# EasyEDA Pro project MiddleMotor.eprj

# Schematic Schematic1
Board Name: Board1; Create Date: 2025-05-16; Page Name: P1; Project Name: MiddleMotor; Schematic Name: Schematic1; Update Date: 2025-05-17; Company: 嘉立创EDA; Drawed: 王大智; Page Size: A4; Version: V1.0
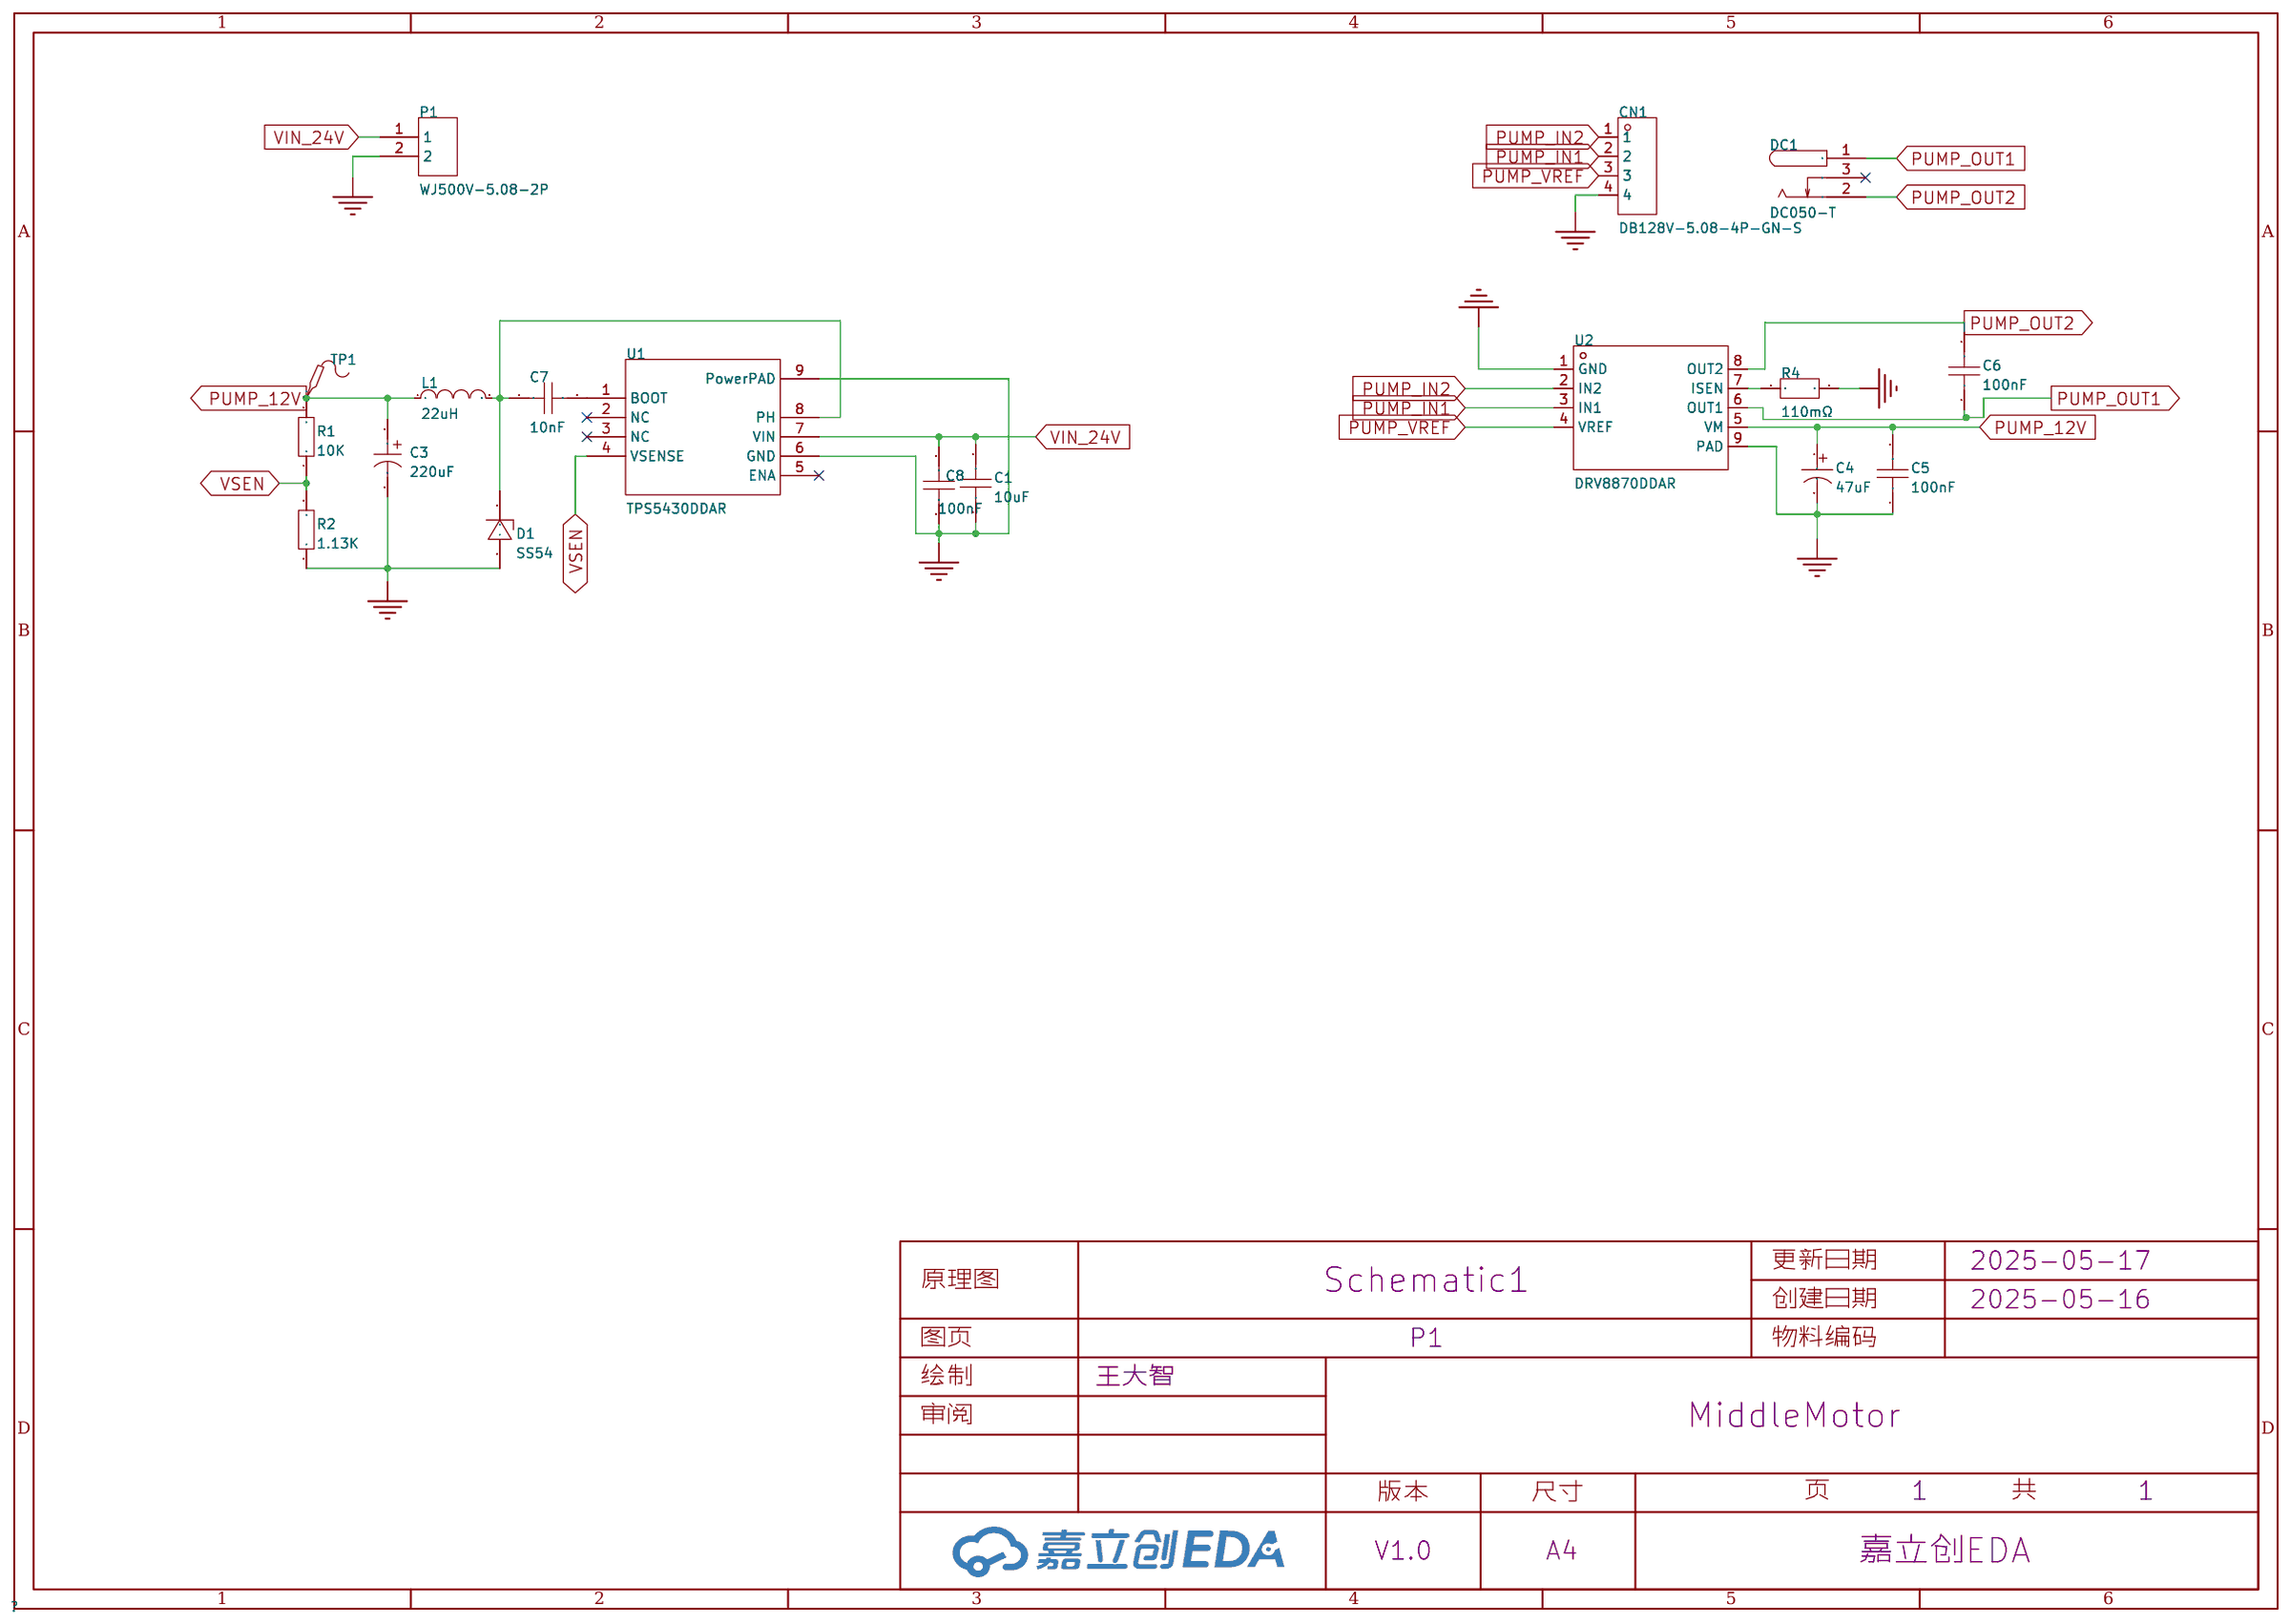
[diagram p0: schematic sheet]

## Parts
C1  10uF  [C1206]
C3  220uF  [CAP-SMD_BD8.0-L8.3-W8.3-FD]
C4  47uF  [CAP-TH_BD6.3-P2.50-D1.0-FD]
C5  100nF  [C0603]
C6  100nF  [C0603]
C7  10nF  [C0603]
C8  100nF  [C0603]
CN1  DB128V-5.08-4P-GN-S  [CONN-TH_4P-P5.08_DIBO_DB128V-5.08]
D1  SS54  [SMA_L4.3-W2.6-LS5.0-FD]
DC1  DC050-T  [DC-IN_DC050-T]
L1  22uH  [IND-SMD_L7.0-W6.6_FXL0630]
P1  WJ500V-5.08-2P  [CONN-TH_2P-P5.00_WJ500V-5.08-2P]
R1  10K  [R0603]
R2  1.13K  [R0603]
R4  110mΩ  [R1206]
TP1  -  [Test-Point-0.5mm]
U1  TPS5430DDAR  [ESOP-8_L4.9-W3.9-P1.27-LS6.0-TL-EP]
U2  DRV8870DDAR  [HSOP-8_L5.0-W4.0-P1.27-LS6.2-BL-EP]

## Library data of the parts
C1 = HGC1206R5106K500NSPJ: LCSC Part Name: 10uF ±10% 50V; Supplier Part: C7432781; Manufacturer: Chinocera(华瓷); Supplier Footprint: 1206; JLCPCB Part Class: 扩展库; Datasheet: https://atta.szlcsc.com/upload/public/pdf/source/20240320/FAC3FEC40A78BC5CCCE96C232A94D860.pdf; Supplier: LCSC; Tolerance: ±10%; Voltage Rating: 50V; Temperature Coefficient: X5R
C3 = GVT1V227M0810CNVC: LCSC Part Name: 220uF ±20% 35V; Supplier Part: C2983323; Manufacturer: HRK(鸿瑞凯电子); Supplier Footprint: SMD,D8xL10.5mm; JLCPCB Part Class: 扩展库; Datasheet: https://atta.szlcsc.com/upload/public/pdf/source/20220321/BA17E910A44EA2B508CDD6AB8BA576BA.pdf; Supplier: LCSC; Tolerance: ±20%; Rated Voltage: 35V; Ripple Current: 175mA@120Hz; φD: 8mm; L: 10.5mm; Lifetime @ Temp: 2000hrs@105℃; Operating Temperature: -55℃~+105℃
C4 = KM476M050E11RR0VH2FP0: 容值:47uF;精度:±20%;额定电压:50V;; LCSC Part Name: 47uF ±20% 50V; Supplier Part: C45101; Manufacturer: CX(承兴); Supplier Footprint: 插件,D6.3xL11mm; JLCPCB Part Class: 扩展库; Datasheet: https://atta.szlcsc.com/upload/public/pdf/source/20230413/4F329AA96A66424FD3FF29340EA7427F.pdf; Supplier: LCSC; Tolerance: ±20%; Rated Voltage: 50V; Lead Spacing: 2.5mm; φD: 6.3mm; L: 11mm; Lifetime @ Temp: 1000hrs@105℃
C5 C6 = CGA0603X7R104K500JT: 容值:100nF;精度:±10%;额定电压:50V;温度系数:X7R;; LCSC Part Name: 100nF ±10% 50V; Supplier Part: C6119867; Manufacturer: HRE(芯声); Supplier Footprint: 0603; JLCPCB Part Class: Extended Part; Datasheet: https://atta.szlcsc.com/upload/public/pdf/source/20250103/C44077DA9E7B3EFAE02F22B6D3D1CBC9.pdf; Supplier: LCSC; Tolerance: ±10%; Voltage Rating: 50V; Temperature Coefficient: X7R
C7 C8 = CAP_0603: Supplier Footprint: 0603
CN1 = DB128V-5.08-4P-GN-S: LCSC Part Name: 1x4P 5.08mm 直插 排数:1 每排P数:4; Supplier Part: C2915641; Manufacturer: DORABO(地博电气); Supplier Footprint: 插件,P=5.08mm; JLCPCB Part Class: 扩展库; Datasheet: https://atta.szlcsc.com/upload/public/pdf/source/20230106/CC449C10514519CDCE20F1C37DBF2DAC.pdf; Supplier: LCSC; Number of Positions or Pins: 1x4P; Pitch: 5.08mm; Color: 绿色; Mounting Type: 直插; Number of Pins: 4P; Number of Rows: 1; Number of PINs Per Row: 4; Screw Specification: M2.5; Current Rating: 16A; Voltage Rating (Max): 300V; Wire Gauge - AWG: 12~22; Wire Gauge - mm2: 2.5; Operating Temperature: -40℃~+105℃
D1 = SS54_C7420369: LCSC Part Name: 电压:40V 电流:5A; Supplier Part: C7420369; Manufacturer: 宏迦橙; Supplier Footprint: SMA(DO-214AC); JLCPCB Part Class: 扩展库; Datasheet: https://atta.szlcsc.com/upload/public/pdf/source/20230828/254C3882F8647358AD9F60DD73611B5E.pdf; Supplier: LCSC; Diode Configuration: 独立式; Forward Voltage (Vf@If): 550mV@5.0A; Reverse Voltage (Vr): 40V; Rectified Current: 5A; Reverse Leakage Current (Ir): 50uA@40V
DC1 = DC050-T: 连接器类型:DC电源插座;安装方式:卧贴;触点内径:2mm;触点外径:6.4mm;额定电流:2A;额定电压:30V;工作温度范围:-25℃~+70℃;; LCSC Part Name: DC电源插座 内径:2mm 外径:6.4mm; Supplier Part: C431534; Manufacturer: SHOU HAN(首韩); Supplier Footprint: SMD; JLCPCB Part Class: 扩展库; Datasheet: https://atta.szlcsc.com/upload/public/pdf/source/20241230/47AFDAED5CA2AEF49E0D72E48671546A.pdf; Supplier: LCSC; Connector Type: DC电源插座; Mounting Style: 卧贴; Inside Contact Diameter: 2mm; Outside Contact Diameter: 6.4mm; Current Rating (Max): 2A; Voltage Rating (Max): 30V; Operating Temperature Range: -25℃~+70℃
L1 = FXL0630-220-M: LCSC Part Name: 22uH ±20% 3A; Supplier Part: C177244; Manufacturer: cjiang(长江微电); Supplier Footprint: SMD,6.6x7mm; JLCPCB Part Class: 扩展库; Datasheet: https://atta.szlcsc.com/upload/public/pdf/source/20240426/3189EA8206330E2108542F9E34E540E7.pdf; Supplier: LCSC; Tolerance: ±20%; Rated Current: 2.5A; Saturation Current (Isat): 3A; DC Resistance (DCR): 200mΩ; Type: 一体成型电感
P1 = WJ500V-5.08-2P: LCSC Part Name: 1x2P 5.08mm 直插 排数:1 每排P数:2; Supplier Part: C8465; Manufacturer: KANGNEX(康奈克斯电气); Supplier Footprint: 插件,P=5.08mm; JLCPCB Part Class: 扩展库; Datasheet: https://atta.szlcsc.com/upload/public/pdf/source/20191225/C8465_02D34CE5B5B4A53DF5891601D97FA9F4.pdf; Supplier: LCSC; Structure: 1x2P; Pitch: 5.08mm; Color: 绿色; Mounting Style: 直插; Current Rating (Max): 18A; Voltage Rating (Max): 250V; Number of Pins: 2P; Number of Rows: 1; Wire Gauge - AWG: 14~30; Wire Gauge - mm2: 2.5; Number of PINs Per Row: 2; Operating Temperature Range: -40℃~+105℃; Screw Specification: M2.5
R1 R2 = Res_0603: Supplier Footprint: 0603
R4 = FRL1206FR110TS: 电阻类型:厚膜电阻;阻值:110mΩ;精度:±1%;功率:250mW;最大工作电压:500V;温度系数:±600ppm/℃;; LCSC Part Name: 110mΩ ±1% 250mW 厚膜电阻; Supplier Part: C2934288; Manufacturer: FOJAN(富捷); Supplier Footprint: 1206; JLCPCB Part Class: 扩展库; Datasheet: https://atta.szlcsc.com/upload/public/pdf/source/20211221/925EC7D7225764EE0046F22065062C87.pdf; Supplier: LCSC; Type: 厚膜电阻; Tolerance: ±1%; Power(Watts): 250mW; Overload Voltage (Max): 500V; Temperature Coefficient: ±600ppm/℃; Operating Temperature Range: -55℃~+155℃
TP1 = Test-Point
U1 = TPS5430DDAR: LCSC Part Name: 宽输入范围、3A输出电流的降压转换器; Supplier Part: C9864; Manufacturer: TI(德州仪器); Supplier Footprint: SOIC-8-EP; JLCPCB Part Class: 基础库; Datasheet: https://www.ti.com/cn/lit/gpn/tps5430; Supplier: LCSC; Function: 降压型; Output Type: 可调; Input Voltage: 5.5V~36V; Output Voltage: 1.221V~32.04V; Output Current: 3A; Switching Frequency: 500kHz; Operating Temperature: -40℃~+125℃@(TJ); Synchronous Rectification: 否; Number of Outputs: 1; Topology: 降压式; Switch tube (built-in/external): 内置
U2 = DRV8870DDAR: DRV8870 具有电流调节功能的 50V、3.6A、H 桥电机驱动器; Supplier Part: C86590; Manufacturer: TI(德州仪器); Supplier Footprint: HSOP-8-EP; JLCPCB Part Class: 扩展库; Datasheet: https://www.ti.com/cn/lit/gpn/drv8870; Supplier: LCSC

## Nets
GND: C1.1 C3.2 C4.2 C5.1 C8.2 CN1.4 D1.1(A) P1.2 R2.1 R4.2 U1.6(GND) U1.9(PowerPAD) U2.1(GND) U2.9(PAD)
VIN_24V: C1.2 C8.1 P1.1 U1.7(VIN)
PUMP_12V: C3.1 C4.1 C5.2 L1.1 R1.2 TP1.1 U2.5(VM)
PUMP_IN1: CN1.2 U2.3(IN1)
PUMP_IN2: CN1.1 U2.2(IN2)
PUMP_OUT1: C6.1 DC1.1 U2.6(OUT1)
PUMP_OUT2: C6.2 DC1.2 U2.8(OUT2)
PUMP_VREF: CN1.3 U2.4(VREF)
VSEN: R1.1 R2.2 U1.4(VSENSE)
$1N1494: R4.1 U2.7(ISEN)
$1N2437: C7.2 U1.1(BOOT)
$1N2465: C7.1 D1.2(K) L1.2 U1.8(PH)

Not connected (* = marked no-connect by the designer): DC1 3*; U1 2(NC)* 3(NC)* 5(ENA)*

# Board PCB1
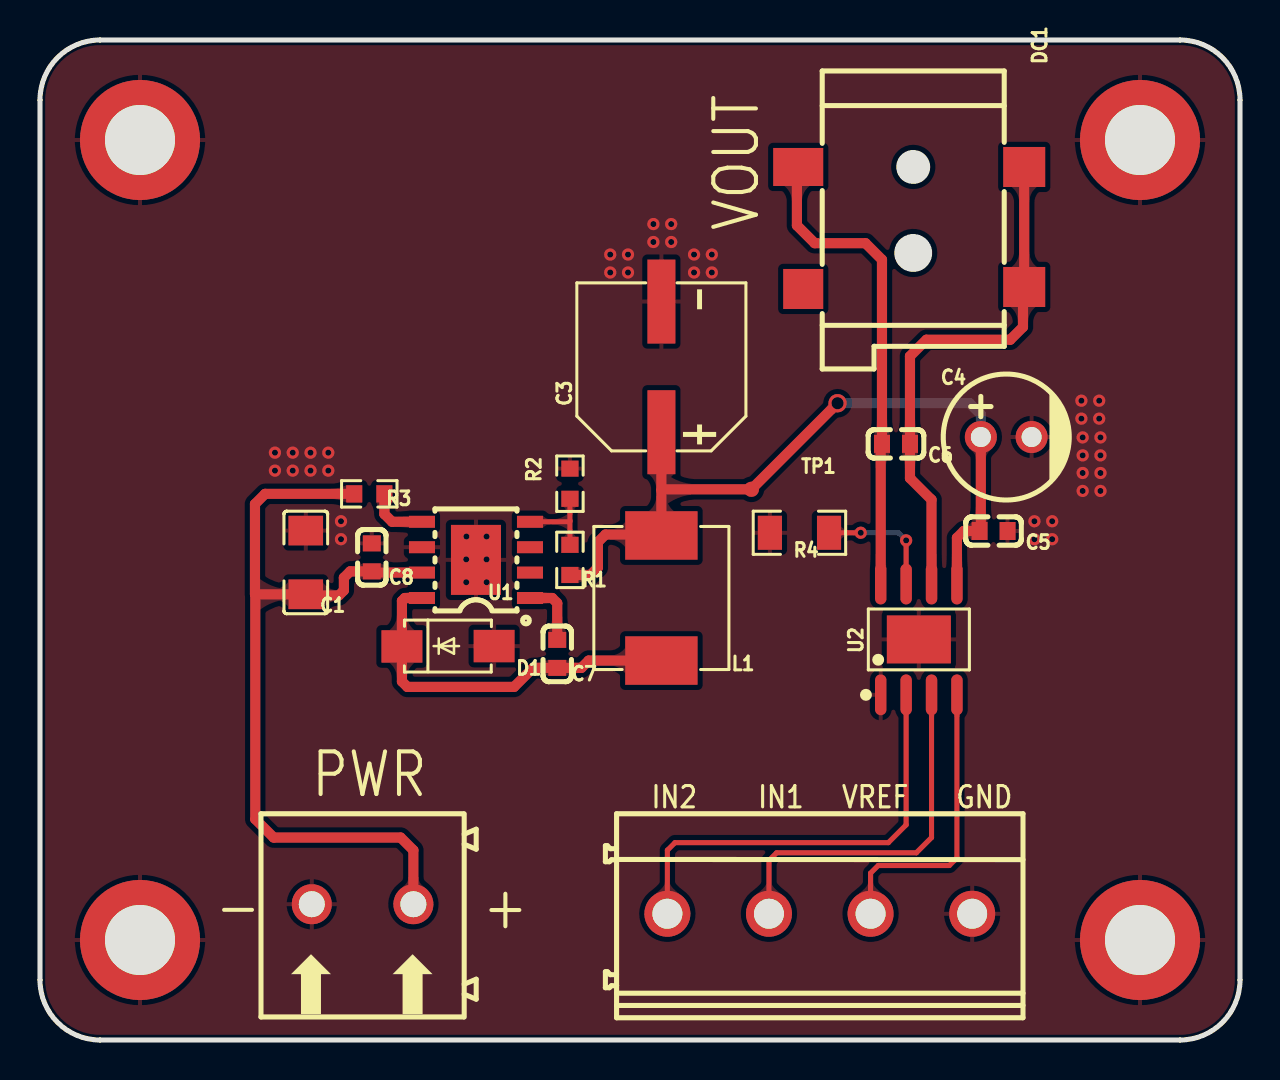
[diagram p1: board, top side]
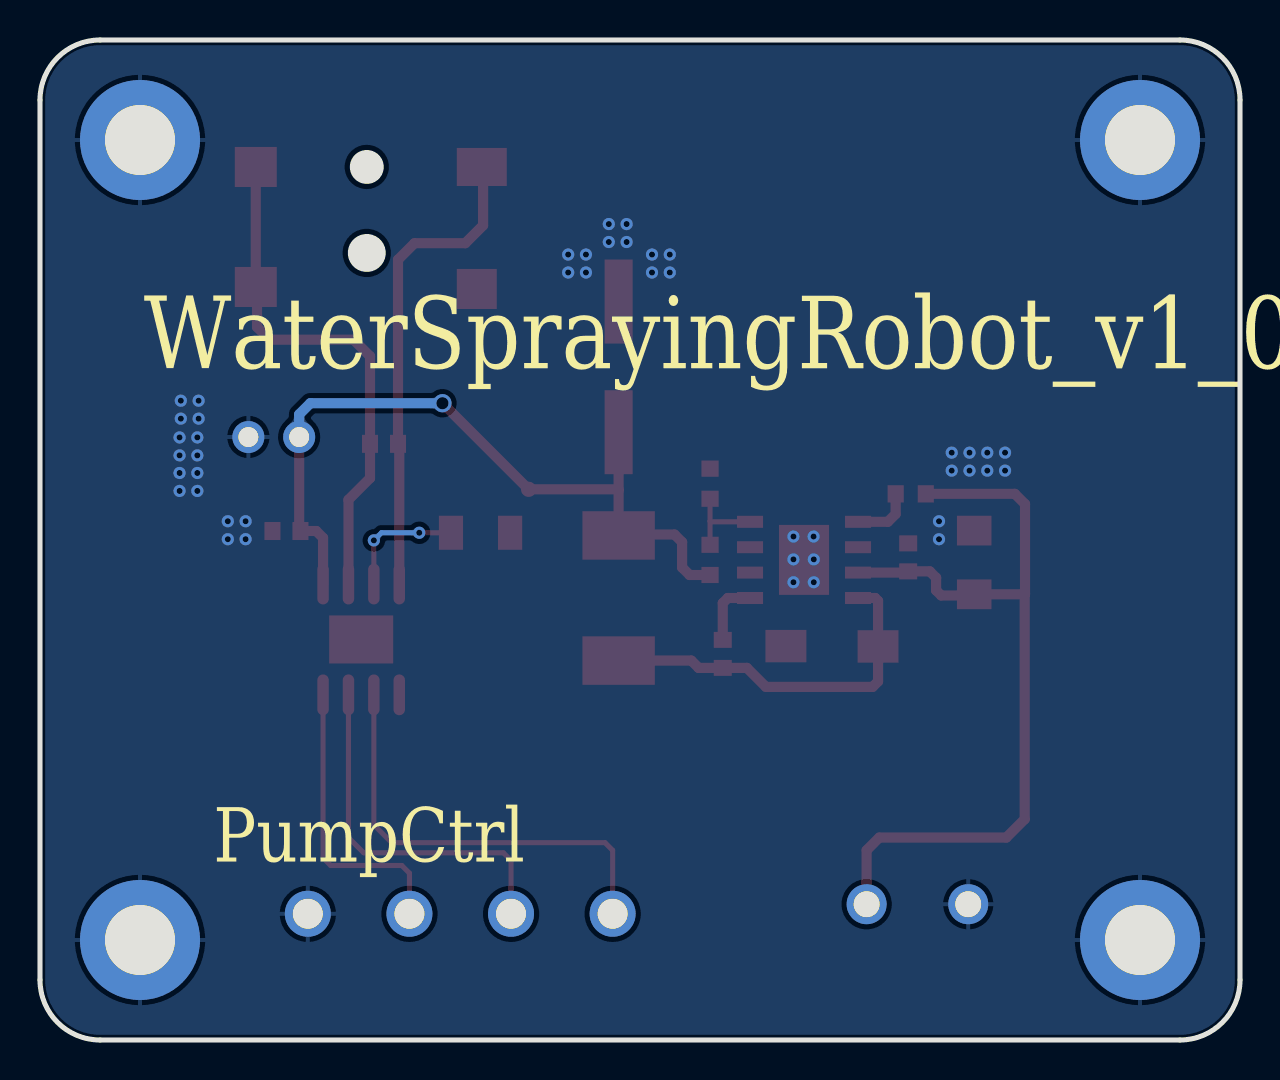
[diagram p2: board, bottom side, seen from below]

Outline 60 x 50 mm; copper layers: Top Layer, Bottom Layer. Coordinates in mm from the lower left corner of the outline.
Outline path: 0,47 0,3 arc(0.88,0.88) 3,0 57,0 arc(59.12,0.88) 60,3 60,47 arc(59.12,49.12) 57,50 3,50 arc(0.88,49.12) 0,47
Stack: Top Layer 0.035mm / Dielectric1 1.51mm FR4 er 4.5 / Bottom Layer 0.035mm

## Design rules (mm)
template: JLCPCB Capability(Two Layers Board)
spacing copperThickness1oz (default): track to track 0.102, other pairs 0.152 to 0.3
spacing copperThickness2oz: track to track 0.203, other pairs 0.152 to 0.3
track width copperThickness1oz (default): min 0.127, default 0.254, max 2.54
track width copperThickness2oz: min 0.203, default 0.254, max 2.54
differential pair differentialPair (default): width min 0.127, default 0.254, max 2.54; gap min 0.152, default 0.152
via viaSize (default): diameter min 0.5, default 0.61, max 10; hole min 0.3, default 0.305, max 6.3

## Placement (name value [footprint] x y rotation side)
C1  10uF  [C1206]  13.29 23.88 270 top
C3  220uF  [CAP-SMD_BD8.0-L8.3-W8.3-FD]  31.07 33.66 90 top
C4  47uF  [CAP-TH_BD6.3-P2.50-D1.0-FD]  48.31 30.15 0 top
C5  100nF  [C0603]  47.68 25.45 180 top
C6  100nF  [C0603]  42.8 29.81 180 top
C7  10nF  [C0603]  25.86 19.31 90 top
C8  100nF  [C0603]  16.59 24.13 90 top
CN1  DB128V-5.08-4P-GN-S  [CONN-TH_4P-P5.08_DIBO_DB128V-5.08]  38.99 6.31 0 top
D1  SS54  [SMA_L4.3-W2.6-LS5.0-FD]  20.4 19.69 180 top
DC1  DC050-T  [DC-IN_DC050-T]  43.56 40.6 270 top
L1  22uH  [IND-SMD_L7.0-W6.6_FXL0630]  31.07 22.1 90 top
NOREF  -  [Pad_e214]  55 5 0 top
NOREF#2  -  [Pad_e212]  5 5 0 top
NOREF#3  -  [Pad_e213]  55 45 0 top
NOREF#4  -  [Pad_e210]  5 45 0 top
P1  WJ500V-5.08-2P  [CONN-TH_2P-P5.00_WJ500V-5.08-2P]  16.13 6.79 180 top
R1  10K  [R0603]  26.5 24 270 top
R2  1.13K  [R0603]  26.5 27.81 270 top
R3  100K  [R0603]  16.46 27.31 180 top
R4  110mΩ  [R1206]  37.97 25.36 180 top
TP1  -  [Test-Point-0.5mm]  35.57 27.53 180 top
U1  TPS5430DDAR  [ESOP-8_L4.9-W3.9-P1.27-LS6.0-TL-EP]  21.8 24 180 top
U2  DRV8870DDAR  [HSOP-8_L5.0-W4.0-P1.27-LS6.2-BL-EP]  43.94 20.03 0 top

## Footprints (pads in the part's own frame, mm; a bottom-side part is the same pattern mirrored in y, then rotated)
C0603
  rect 0.8x0.9 smd: 1(-0.7,0) 2(0.7,0)
C1206
  rect 1.485x1.728 smd: 1(-1.593,0) 2(1.593,0)
CAP-SMD_BD8.0-L8.3-W8.3-FD
  rect 4.2x1.4 smd: 1(-3.267,0) 2(3.267,0)
CAP-TH_BD6.3-P2.50-D1.0-FD
  round 1.6 hole 1: 1(-1.27,0) 2(1.27,0)
CONN-TH_2P-P5.00_WJ500V-5.08-2P
  round 2 hole 1.3: 1(-2.54,0) 2(2.54,0)
CONN-TH_4P-P5.08_DIBO_DB128V-5.08
  round 2.3 hole 1.5: 1(-7.62,0) 2(-2.54,0) 3(2.54,0) 4(7.62,0)
DC-IN_DC050-T
  rect 2x2.1 smd: 1(-3.05,5.65) 1(2.95,5.65)
  rect 1.9x2.5 smd: 2(-3.05,-5.65)
  rect 2x2 smd: 3(3.05,-5.4)
ESOP-8_L4.9-W3.9-P1.27-LS6.0-TL-EP
  rect 1.3x0.6 smd: 1(-2.7,1.905) 2(-2.7,0.635) 3(-2.7,-0.635) 4(-2.7,-1.905) 5(2.7,-1.905) 6(2.7,-0.635) 7(2.7,0.635) 8(2.7,1.905)
  rect 2.5x3.5 smd: 9(0,0)
HSOP-8_L5.0-W4.0-P1.27-LS6.2-BL-EP
  oval 0.574x2.038 smd: 1(-1.905,-2.769) 2(-0.635,-2.769) 3(0.635,-2.769) 4(1.905,-2.769) 5(1.905,2.769) 6(0.635,2.769) 7(-0.635,2.769) 8(-1.905,2.769)
  rect 3.2x2.4 smd: 9(0,0)
IND-SMD_L7.0-W6.6_FXL0630
  rect 2.424x3.62 smd: 1(3.128,0) 2(-3.128,0)
Pad_e210
  round 6 hole 3.5: 1(0,0)
Pad_e212
  round 6 hole 3.5: 1(0,0)
Pad_e213
  round 6 hole 3.5: 1(0,0)
Pad_e214
  round 6 hole 3.5: 1(0,0)
R0603
  rect 0.806x0.864 smd: 1(-0.753,0) 2(0.753,0)
R1206
  rect 1.208x1.701 smd: 1(-1.479,0) 2(1.479,0)
SMA_L4.3-W2.6-LS5.0-FD
  rect 2.046x1.62 smd: 1(-2.304,-0.009) 2(2.304,0.009)
Test-Point-0.5mm
  round 0.762 smd: 1(0,0)

## Nets
GND: C1.1 C3.2 C4.2 C5.1 C8.2 CN1.4 D1.1 NOREF.1 NOREF#2.1 NOREF#3.1 NOREF#4.1 P1.2 R2.1 R4.2 U1.6 U1.9 U2.1 U2.9
VIN_24V: C1.2 C8.1 P1.1 R3.2 U1.7
PUMP_12V: C3.1 C4.1 C5.2 L1.1 R1.2 TP1.1 U2.5
PUMP_IN1: CN1.2 U2.3
PUMP_IN2: CN1.1 U2.2
PUMP_OUT1: C6.1 DC1.1 U2.6
PUMP_OUT2: C6.2 DC1.2 U2.8
PUMP_VREF: CN1.3 U2.4
VSEN: R1.1 R2.2 U1.4
$1N979: R3.1 U1.5
$1N1494: R4.1 U2.7
$1N2437: C7.2 U1.1
$1N2465: C7.1 D1.2 L1.2 U1.8

Pads without a net: DC1 3; U1 2 3

## Via types
v1: diameter 0.61, hole 0.305, Top Layer to Bottom Layer, 46 vias
v2: diameter 0.914, hole 0.61, Top Layer to Bottom Layer, 1 via

## Routing (per net, layer and track width the routed paths; a pad name or vN(x,y) marks a point on that pad's centre or on a via; arc(x,y) is an arc through that point)
GND:
  vias: v1(11.75,29.37) v1(11.75,28.47) v1(12.64,29.37) v1(12.64,28.47) v1(13.53,29.37) v1(13.53,28.47) v1(14.41,29.37) v1(14.41,28.47) v1(15.05,25.94) v1(15.05,25.04) v1(21.32,25.17) v1(21.31,24.03) v1(21.31,22.89) v1(22.33,25.17) v1(22.33,24.03) v1(22.33,22.89) v1(28.51,39.27) v1(28.51,38.38) v1(29.4,39.27) v1(29.4,38.38) v1(30.67,40.8) v1(30.67,39.9) v1(31.56,40.8) v1(31.56,39.9) v1(32.7,39.27) v1(32.7,38.38) v1(33.59,39.27) v1(33.59,38.38) v1(49.72,25.94) v1(49.72,25.04) v1(50.61,25.94) v1(50.61,25.04) v1(52.07,31.97) v1(52.07,31.07) v1(52.13,30.13) v1(52.13,29.23) v1(52.13,28.35) v1(52.13,27.45) v1(52.96,31.97) v1(52.96,31.07) v1(53.02,30.13) v1(53.02,29.23) v1(53.02,28.35) v1(53.02,27.45)
VIN_24V: length 41.4
  Top Layer w0.508: 10.76,22.28 C1.2 13.35,22.23 14.94,22.23 15.19,22.48 15.19,23.12 15.51,23.43 C8.1 16.65,23.37 U1.7 ; 10.76,22.28 10.76,11.04 11.68,10.12 18.03,10.12 18.67,9.49 P1.1 ; 10.76,22.28 10.75,22.3 10.75,26.8 11.26,27.31 R3.2
PUMP_12V: length 38.8
  Top Layer w0.508: 26.5,23.25 27.52,23.25 27.89,23.62 27.89,24.89 28.28,25.27 31.02,25.27 L1.1 31.07,27.49 ; 31.07,27.49 31.11,27.53 TP1.1 39.87,31.84 v2(39.88,31.84) ; 31.07,27.49 C3.1 ; 45.85,22.8 45.85,25.11 46.19,25.45 C5.2 47.04,25.51 C4.1
  Bottom Layer w0.508: v2(39.88,31.84) 46.48,31.84 47.04,31.28 C4.1
PUMP_IN1: length 18.4
  Top Layer w0.254: CN1.2 36.45,8.98 36.83,9.36 43.81,9.36 44.58,10.12 U2.3
PUMP_IN2: length 22.1
  Top Layer w0.254: U2.2 43.31,10.76 42.42,9.87 31.75,9.87 31.37,9.49 CN1.1
PUMP_OUT1: length 26.1
  Top Layer w0.508: 44.58,22.8 44.58,27.01 43.5,28.09 C6.1 43.5,34.19 44.32,35.01 48.51,35.01 49.15,35.65 49.15,37.59 DC1.1 DC1.1
PUMP_OUT2: length 24.2
  Top Layer w0.508: 42.04,22.8 42.04,29.75 C6.2 42.1,39.02 41.28,39.84 38.74,39.84 37.85,40.73 37.85,43.59 DC1.2
PUMP_VREF: length 14.8
  Top Layer w0.254: U2.4 45.85,9.11 45.47,8.72 41.91,8.72 41.53,8.34 CN1.3
VSEN: length 4.3
  Top Layer w0.254: 26.5,25.94 R2.2 ; 26.5,25.94 R1.1 ; 26.5,25.94 26.47,25.91 U1.4
$1N979: length 3
  Top Layer w0.508: R3.1 17.22,26.3 17.61,25.91 U1.5
$1N1494: length 6.2
  Top Layer w0.254: v1(43.31,24.98) 43.31,22.8 ; R4.1 v1(41.04,25.36)
  Bottom Layer w0.254: v1(41.04,25.36) 42.93,25.36 v1(43.31,24.98)
$1N2437: length 3.3
  Top Layer w0.508: U1.1 25.61,22.1 25.86,21.85 C7.2
$1N2465: length 18.7
  Top Layer w0.508: L1.2 27.43,18.97 27.07,18.61 C7.1 24.65,18.61 23.7,17.65 18.37,17.65 18.1,17.93 D1.2 18.1,21.95 18.24,22.1 U1.8

## Copper pours and planes (outline as drawn; the poured copper is in the pictures)
GND on Top Layer: -9.78,56.35 67.44,56.35 67.44,-6.51 -9.78,-6.51
GND on Bottom Layer: -5.59,56.1 67.69,56.1 67.69,-7.53 -5.59,-7.53

Small or netless copper shapes (teardrops, artwork), in the pictures only: 54 on Top Layer, 4 on Bottom Layer

## Text on the board
Bottom Silkscreen Layer: PumpCtrl | WaterSprayingRobot_v1_0_2
Top Silkscreen Layer: IN2 | IN1 | VREF | GND | - | PWR | + | VOUT
